# EAGLE design new_and_improved_board (EAGLE 9.5.0)
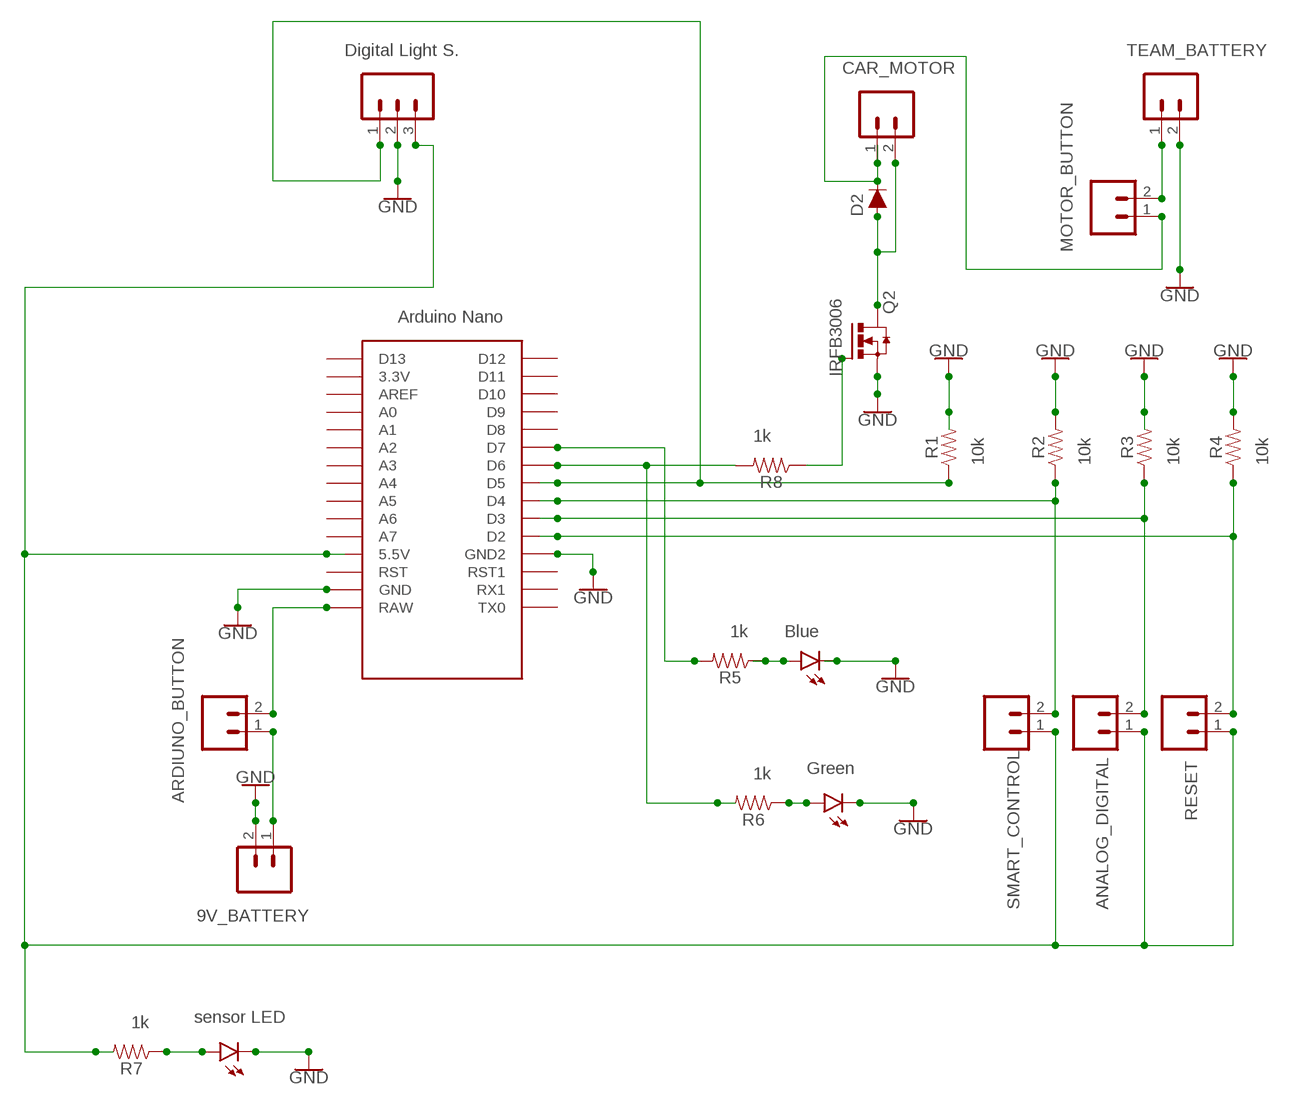
[diagram p0: schematic, sheet 1]

## Parts
D2  200mA/100V/1V  DIODE-1N4148  [DIODE-1N4148]
D4  LED3MM  [LED_3MM]
D5  LED3MM  [LED_3MM]
D6  LED3MM  [LED_3MM]
J1  CONN_02  [1X02]
J2  CONN_02  [1X02]
J3  CONN_02  [1X02]
J4  455-1750-1-ND  CONN_03  [1X03]
Q2  IRF3704L-V  [TO262-V]
R1  1M  1MOHM-HORIZ-1/6W-5%  [AXIAL-0.3]
R2  1M  1MOHM-HORIZ-1/6W-5%  [AXIAL-0.3]
R3  1M  1MOHM-HORIZ-1/6W-5%  [AXIAL-0.3]
R4  1M  1MOHM-HORIZ-1/6W-5%  [AXIAL-0.3]
R5  1M  1MOHM-HORIZ-1/6W-5%  [AXIAL-0.3]
R6  1M  1MOHM-HORIZ-1/6W-5%  [AXIAL-0.3]
R7  1M  1MOHM-HORIZ-1/6W-5%  [AXIAL-0.3]
R8  1M  1MOHM-HORIZ-1/6W-5%  [AXIAL-0.3]
S1  CONN_02  [1X02]
S2  CONN_02  [1X02]
S3  CONN_02  [1X02]
S4  CONN_02  [1X02]
S5  CONN_02  [1X02]
U$1  NANO  [NANO]

## Nets
5V: J4.3 R7.P$2 S2.1 S4.1 S5.1 U$1.5V(5.5V)
9V: S1.2 U$1.RAW
9VBAT: J2.1 S1.1
GND: D4.K(C) D5.K(C) D6.K(C) J2.2 J3.2 J4.2 Q2.3(S) R1.P$2 R2.P$2 R3.P$2 R4.P$2 U$1.GND U$1.GND1(GND2)
N$1: R6.P$2 R8.P$2 U$1.D6
N$2: D2.A J1.2 Q2.2(D)
N$3: Q2.1(G) R8.P$1
N$4: J4.1 R1.P$1 U$1.D5
N$5: R2.P$1 S2.2 U$1.D4
N$6: R3.P$1 S4.2 U$1.D3
N$7: R4.P$1 S5.2 U$1.D2
N$8: R5.P$2 U$1.D7
N$9: D4.A R5.P$1
N$10: D5.A R6.P$1
N$11: D2.C J1.1 S3.1
N$15: J3.1 S3.2
N$17: D6.A R7.P$1
Unconnected: U$1.3.3V U$1.A0 U$1.A1 U$1.A2 U$1.A3 U$1.A4 U$1.A5 U$1.A6 U$1.A7 U$1.AREF U$1.D8 U$1.D9 U$1.D10 U$1.D11 U$1.D12 U$1.D13 U$1.ICSP1 U$1.ICSP2 U$1.ICSP3 U$1.ICSP4 U$1.ICSP5 U$1.ICSP6 U$1.RST U$1.RST1 U$1.RX1 U$1.TX0

## Library data of the parts
D2 = SparkFun-DiscreteSemi:DIODE: Diode These are standard reverse protection diodes and small signal diodes. SparkFun Products: SparkFun SparkPunk Sound Kit <https://www.sparkfun.com/products/11177> SparkFun ESP8266 Thing <https://www.sparkfun.com/products/13231>; PROD_ID: DIO-08378
D4 = SparkFun-LED:LED: LED (Generic) Standard schematic elements and footprints for 5mm, 3mm, 1206, and 0603 sized LEDs. Generic LEDs with no color specified.; PROD_ID: Blue
D5 = SparkFun-LED:LED: LED (Generic) Standard schematic elements and footprints for 5mm, 3mm, 1206, and 0603 sized LEDs. Generic LEDs with no color specified.; PROD_ID: Green
D6 = SparkFun-LED:LED: LED (Generic) Standard schematic elements and footprints for 5mm, 3mm, 1206, and 0603 sized LEDs. Generic LEDs with no color specified.; PROD_ID: sensor LED
J1 J3 S1-S5 = SparkFun-Connectors:CONN_02: Multi connection point. Often used as Generic Header-pin footprint for 0.1 inch spaced/style header connections On any of the 0.1 inch spaced packages, you can populate with these: Break Away Headers - Straight <https://www.sparkfun.com/products/116> (PRT-00116) Break Away Male Headers - Right Angle <https://www.sparkfun.com/products/553> (PRT-00553) Female Headers <https://www.sparkfun.com/products/115> (PRT-00115) Break Away Headers - Machine Pin <https://www.sparkfun.com/products/117> (PRT-00117) Break Away Female Headers - Swiss Machine Pin <https://www.sparkfun.com/products/743> (PRT-00743) For SCREWTERMINALS and SPRING TERMINALS visit here: Screw Terimnals on SparkFun.com <https://www.sparkfun.com/search/results?term=Screw+Terminals> (5mm/3.5mm/2.54mm spacing) This device is also useful as a general connection point to wire up your design to another part of your project. Our various solder wires solder well into these plated through hole pads. Hook-Up Wire - Assortment (Stranded, 22 AWG) <https://www.sparkfun.com/products/11375> (PRT-11375) Hook-Up Wire - Assortment (Solid Core, 22 AWG) <https://www.sparkfun.com/products/11367> (PRT-11367) View the entire wire category on our website here <https://www.sparkfun.com/categories/141> Special notes: Molex polarized connector foot print use with: PRT-08233 with associated crimp pins and housings. 2.54_SCREWTERM for use with PRT-10571. 3.5mm Screw Terminal footprints for PRT-08084 5mm Screw Terminal footprints for use with PRT-08432
J2 = SparkFun-Connectors:CONN_02: Multi connection point. Often used as Generic Header-pin footprint for 0.1 inch spaced/style header connections On any of the 0.1 inch spaced packages, you can populate with these: Break Away Headers - Straight <https://www.sparkfun.com/products/116> (PRT-00116) Break Away Male Headers - Right Angle <https://www.sparkfun.com/products/553> (PRT-00553) Female Headers <https://www.sparkfun.com/products/115> (PRT-00115) Break Away Headers - Machine Pin <https://www.sparkfun.com/products/117> (PRT-00117) Break Away Female Headers - Swiss Machine Pin <https://www.sparkfun.com/products/743> (PRT-00743) For SCREWTERMINALS and SPRING TERMINALS visit here: Screw Terimnals on SparkFun.com <https://www.sparkfun.com/search/results?term=Screw+Terminals> (5mm/3.5mm/2.54mm spacing) This device is also useful as a general connection point to wire up your design to another part of your project. Our various solder wires solder well into these plated through hole pads. Hook-Up Wire - Assortment (Stranded, 22 AWG) <https://www.sparkfun.com/products/11375> (PRT-11375) Hook-Up Wire - Assortment (Solid Core, 22 AWG) <https://www.sparkfun.com/products/11367> (PRT-11367) View the entire wire category on our website here <https://www.sparkfun.com/categories/141> Special notes: Molex polarized connector foot print use with: PRT-08233 with associated crimp pins and housings. 2.54_SCREWTERM for use with PRT-10571. 3.5mm Screw Terminal footprints for PRT-08084 5mm Screw Terminal footprints for use with PRT-08432; 9V_BATTERY: 9V
J4 = SparkFun-Connectors:CONN_03: Multi connection point. Often used as Generic Header-pin footprint for 0.1 inch spaced/style header connections On any of the 0.1 inch spaced packages, you can populate with these: Break Away Headers - Straight <https://www.sparkfun.com/products/116> (PRT-00116) Break Away Male Headers - Right Angle <https://www.sparkfun.com/products/553> (PRT-00553) Female Headers <https://www.sparkfun.com/products/115> (PRT-00115) Break Away Headers - Machine Pin <https://www.sparkfun.com/products/117> (PRT-00117) Break Away Female Headers - Swiss Machine Pin <https://www.sparkfun.com/products/743> (PRT-00743) Stackable Header - 3 Pin (Female, 0.1") <https://www.sparkfun.com/products/13875> (PRT-13875) For SCREWTERMINALS and SPRING TERMINALS visit here: Screw Terimnals on SparkFun.com <https://www.sparkfun.com/search/results?term=Screw+Terminals> (5mm/3.5mm/2.54mm spacing) This device is also useful as a general connection point to wire up your design to another part of your project. Our various solder wires solder well into these plated through hole pads. Hook-Up Wire - Assortment (Stranded, 22 AWG) <https://www.sparkfun.com/products/11375> (PRT-11375) Hook-Up Wire - Assortment (Solid Core, 22 AWG) <https://www.sparkfun.com/products/11367> (PRT-11367) View the entire wire category on our website here <https://www.sparkfun.com/categories/141> Special notes: Molex polarized connector foot print use with SKU : PRT-08232 with associated crimp pins and housings.; PROD_ID: Digital Light S.
Q2 = transistor-power:IRF3704: SMPS MOSFET HEXFET® Power MOSFET Source: http://www.irf.com/product-info/datasheets/data/irf3704.pdf
R1-R4 = SparkFun-Resistors:1MOHM: 1MΩ resistor A resistor is a passive two-terminal electrical component that implements electrical resistance as a circuit element. Resistors act to reduce current flow, and, at the same time, act to lower voltage levels within circuits. - Wikipedia; PROD_ID: 10k
R5-R8 = SparkFun-Resistors:1MOHM: 1MΩ resistor A resistor is a passive two-terminal electrical component that implements electrical resistance as a circuit element. Resistors act to reduce current flow, and, at the same time, act to lower voltage levels within circuits. - Wikipedia; PROD_ID: 1k
U$1 = Arduino-clone:NANO: Arduino Nano

## Board
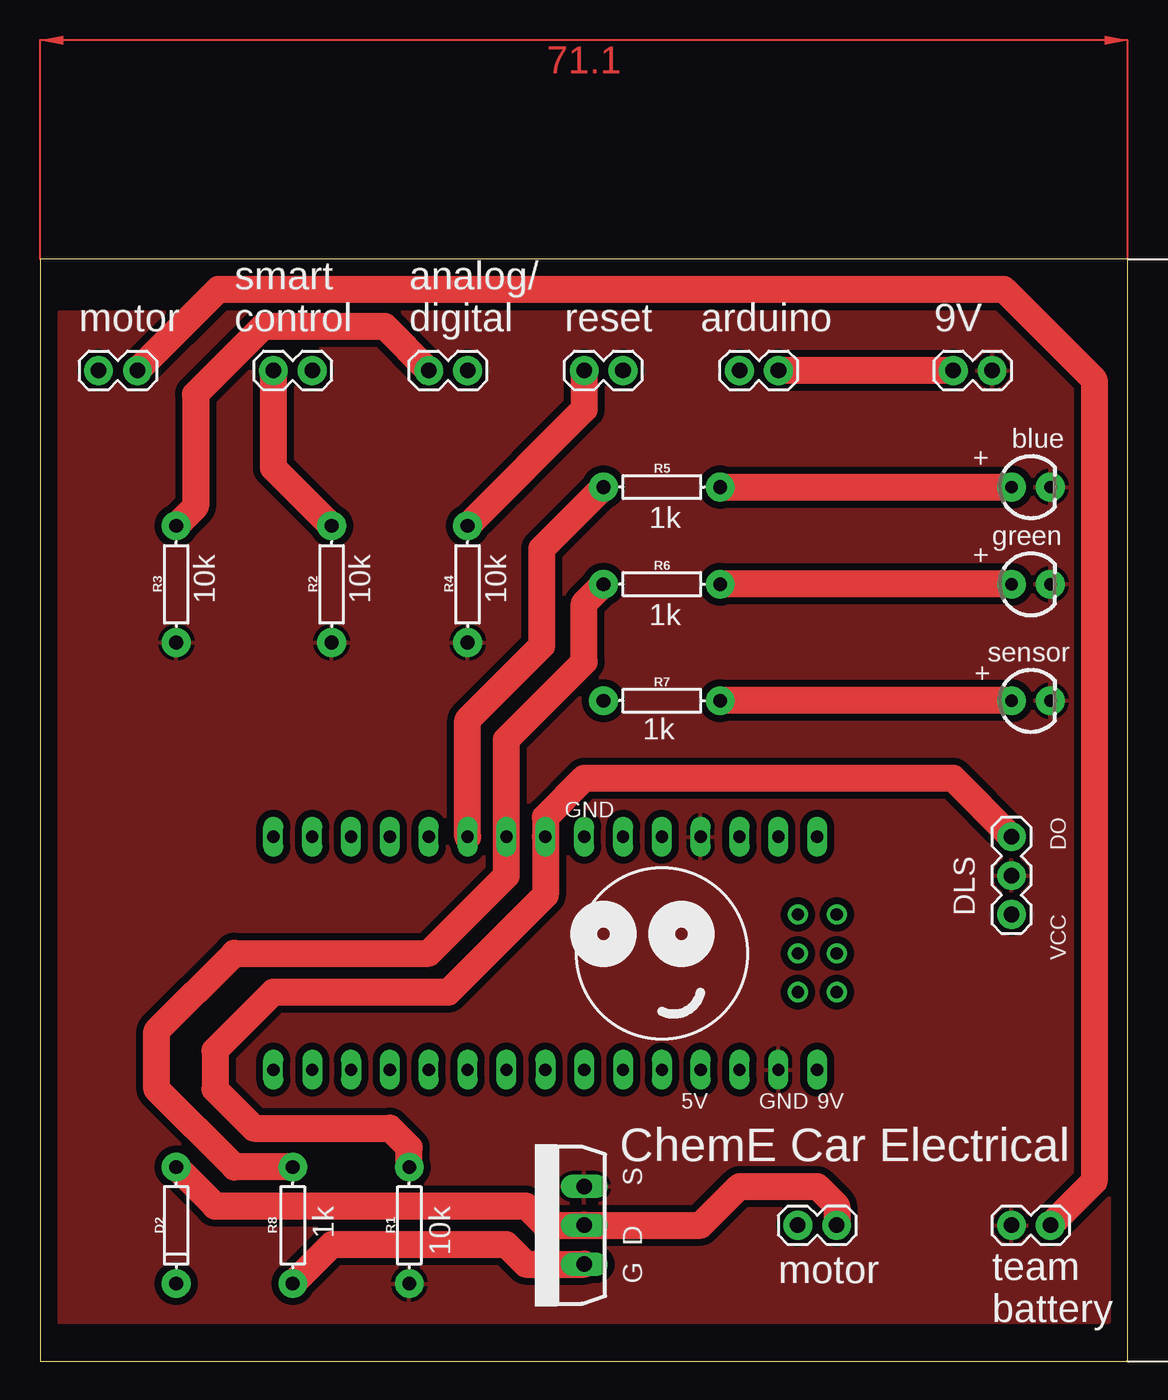
[diagram p1: board, top side]
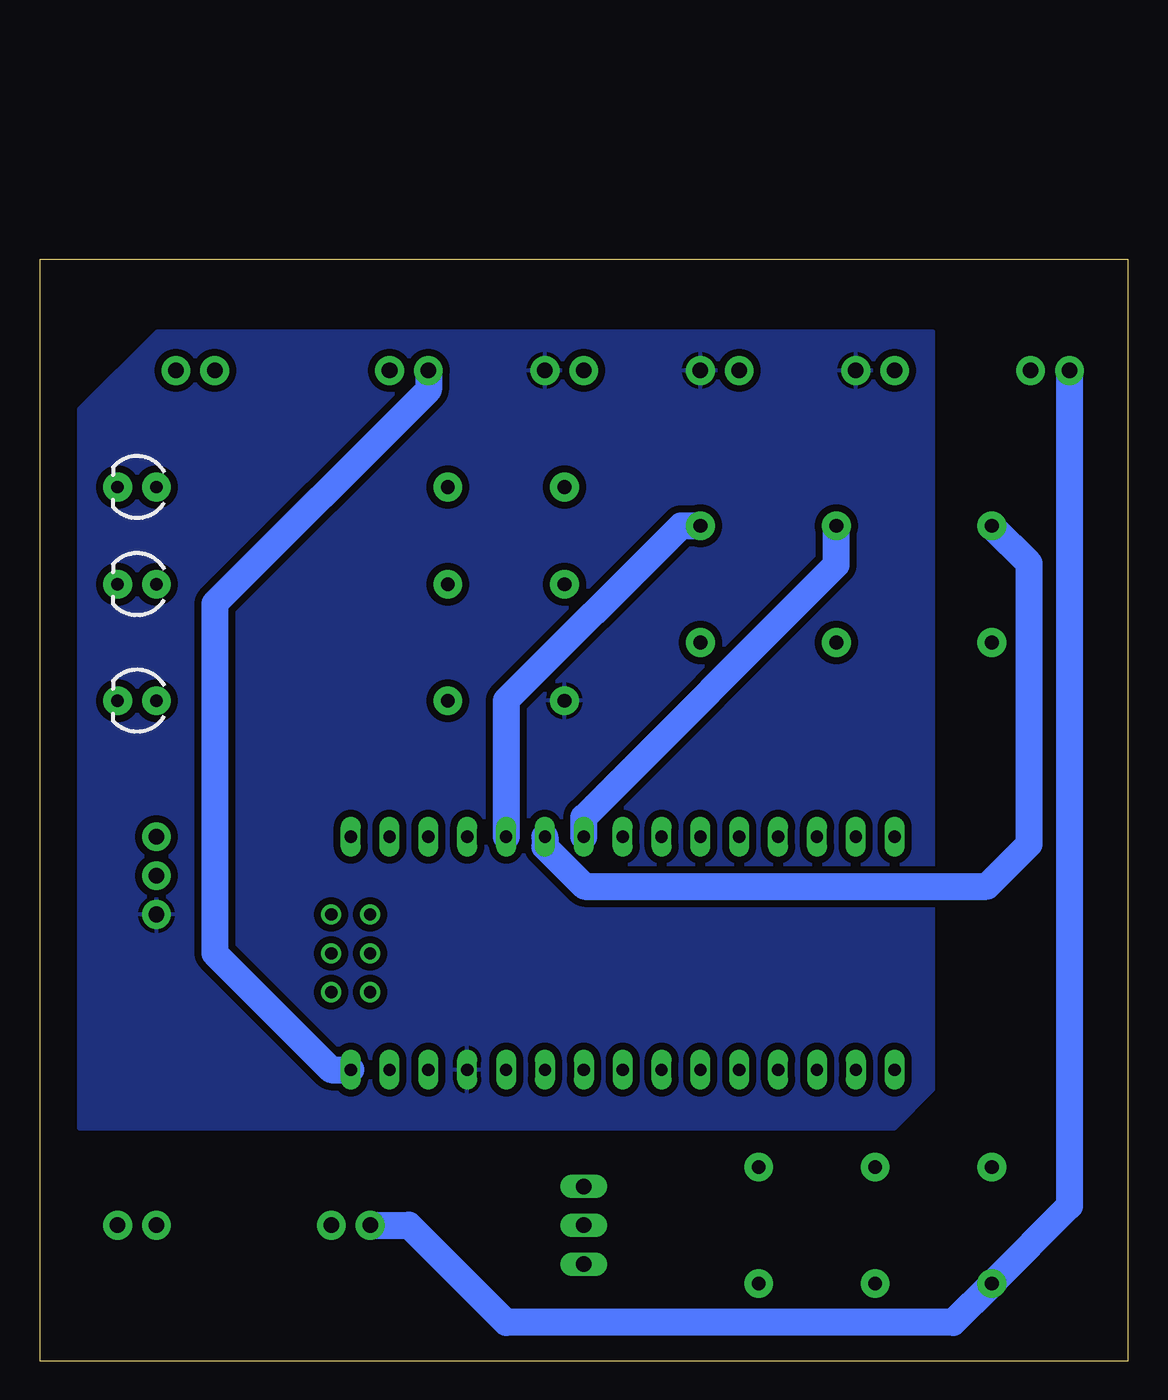
[diagram p2: board, bottom side, seen from below]

Size 71.1 x 72.06 mm. Coordinates in mm from the lower left corner, seen from the top.
Outline: 0,0 71.1,0 71.1,72.06 0,72.06 0,0
Copper layers (1*16): Top 0.035mm / dielectric 0.15mm / Bottom 0.035mm
Design rules "default": minimum track width 6mil, minimum drill 0.35mm, track to track 6mil, track to pad 6mil, pad to pad 6mil, via to via 6mil, smd to smd 6mil, copper to edge 40mil, drill to drill 6mil, minimum pad ring 10mil, minimum via ring 8mil, stop-mask expansion 4mil, vias tented up to drill 0mil, thermal gap 10mil

### Footprints (pad centres in the part's own frame; a part is rotated, then mirrored left to right if it is on the bottom)
DIODE-1N4148 = drill 0.9 pad 1.88: A -3.81,0; C 3.81,0
LED_3MM = drill 0.813 pad 1.88: A -1.27,0; K 1.27,0
1X02 = drill 1.016 pad 1.88: 1 0,0; 2 2.54,0
1X03 = drill 1.016 pad 1.88: 1 0,0; 2 2.54,0; 3 5.08,0
TO262-V = drill 1.016 long: 1 -2.54,0; 2 0,0; 3 2.54,0
AXIAL-0.3 = drill 0.9 pad 1.88: P$1 -3.81,0; P$2 3.81,0
NANO = drill 0.8 long: 3.3V -10.16,24.13; 5V -10.16,-1.27; A0 -10.16,19.05; A1 -10.16,16.51; A2 -10.16,13.97; A3 -10.16,11.43; A4 -10.16,8.89; A5 -10.16,6.35; A6 -10.16,3.81; A7 -10.16,1.27; AREF -10.16,21.59; D2 5.08,1.27; D3 5.08,3.81; D4 5.08,6.35; D5 5.08,8.89; D6 5.08,11.43; D7 5.08,13.97; D8 5.08,16.51; D9 5.08,19.05; D10 5.08,21.59; D11 5.08,24.13; D12 5.08,26.67; D13 -10.16,26.67; GND -10.16,-6.35; GND1 5.08,-1.27; RAW -10.16,-8.89; RST -10.16,-3.81; RST1 5.08,-3.81; RX1 5.08,-6.35; TX0 5.08,-8.89 | drill 0.8: ICSP1 -5.08,-10.16; ICSP2 -5.08,-7.62; ICSP3 -2.54,-10.16; ICSP4 -2.54,-7.62; ICSP5 0,-10.16; ICSP6 0,-7.62

### Placement (x,y rotation side)
D2  8.89,8.89 270 top
D4  64.77,57.15 0 top
D5  64.77,50.8 0 top
D6  64.77,43.18 0 top
J1  49.53,8.89 0 top
J2  59.69,64.77 0 top
J3  66.04,8.89 180 top
J4  63.5,34.29 270 top
Q2  35.56,8.89 90 top
R1  24.13,8.89 270 top
R2  19.05,50.8 270 top
R3  8.89,50.8 270 top
R4  27.94,50.8 270 top
R5  40.64,57.15 180 top
R6  40.64,50.8 180 top
R7  40.64,43.18 180 top
R8  16.51,8.89 90 top
S1  48.26,64.77 180 top
S2  17.78,64.77 180 top
S3  3.81,64.77 0 top
S4  27.94,64.77 180 top
S5  38.1,64.77 180 top
U$1  41.91,29.21 90 top

### Tracks (layer width: path | path; a pad name or v marks a point on that pad's centre or on a via)
5V
  pour Bottom (isolate 0.457): 12.7,67.31 63.5,67.31 68.58,62.23 68.58,15.24 15.24,15.24 12.7,17.78
9V
  Bottom 1.778: S1.2 45.72,63.5 59.69,49.53 59.69,26.67 52.07,19.05 U$1.RAW
9VBAT
  Top 1.778: J2.1 S1.1
GND
  pour Top (isolate 0.457): 1.27,68.58 69.85,68.58 69.85,2.54 1.27,2.54
N$1
  Top 1.778: R8.P$2 12.7,12.7 7.62,17.78 7.62,21.59 12.7,26.67 25.4,26.67 30.48,31.75 U$1.D6 30.48,40.64 35.56,45.72 35.56,49.53 R6.P$2
N$2
  Top 1.778: J1.2 52.07,10.16 50.8,11.43 45.72,11.43 43.18,8.89 Q2.2 33.02,8.89 31.75,10.16 11.43,10.16 D2.A
N$3
  Top 1.778: R8.P$1 19.05,7.62 30.48,7.62 31.75,6.35 Q2.1
N$4
  Top 1.778: J4.1 59.69,38.1 35.56,38.1 33.02,35.56 U$1.D5 33.02,30.48 26.67,24.13 15.24,24.13 11.43,20.32 11.43,17.78 13.97,15.24 22.86,15.24 24.13,13.97 R1.P$1
N$5
  Top 1.778: S2.2 15.24,58.42 R2.P$1
  Bottom 1.778: U$1.D4 35.56,35.56 19.05,52.07 R2.P$1
N$6
  Top 1.778: S4.2 22.53,67.64 14.58,67.64 10.16,63.22 10.16,55.88 R3.P$1
  Bottom 1.778: U$1.D3 38.1,33.64 35.52,31.05 9.21,31.05 6.45,33.81 6.45,52.17 R3.P$1
N$7
  Top 1.778: S5.2 35.56,62.23 R4.P$1
  Bottom 1.778: R4.P$1 29.21,54.61 40.64,43.18 U$1.D2
N$8
  Top 1.778: R5.P$2 32.79,53.11 32.79,46.76 27.94,41.91 U$1.D7
N$9
  Top 1.778: R5.P$1 D4.A
N$10
  Top 1.778: D5.A R6.P$1
N$11
  Bottom 1.778: S3.1 3.81,10.16 D2.C 11.43,2.54 40.64,2.54 46.99,8.89 J1.1
N$15
  Top 1.778: S3.2 11.66,70.08 62.99,70.08 68.91,64.16 68.91,11.76 J3.1
N$17
  Top 1.778: D6.A R7.P$1
(copper drawn outside any net)
  shapes: Top area x1

### Text on the board
tPlace: motor | smart / control | analog/ / digital | reset | arduino | 9V | blue | + | 1k | green | + | 10k | 10k | 10k | 1k | sensor | + | 1k | GND | DO | DLS | VCC | 5V | GND | 9V | ChemE Car Electrical | S | 1k | 10k | D | G | motor | team / battery